# EAGLE design 1541-3m (EAGLE 6.6.0)
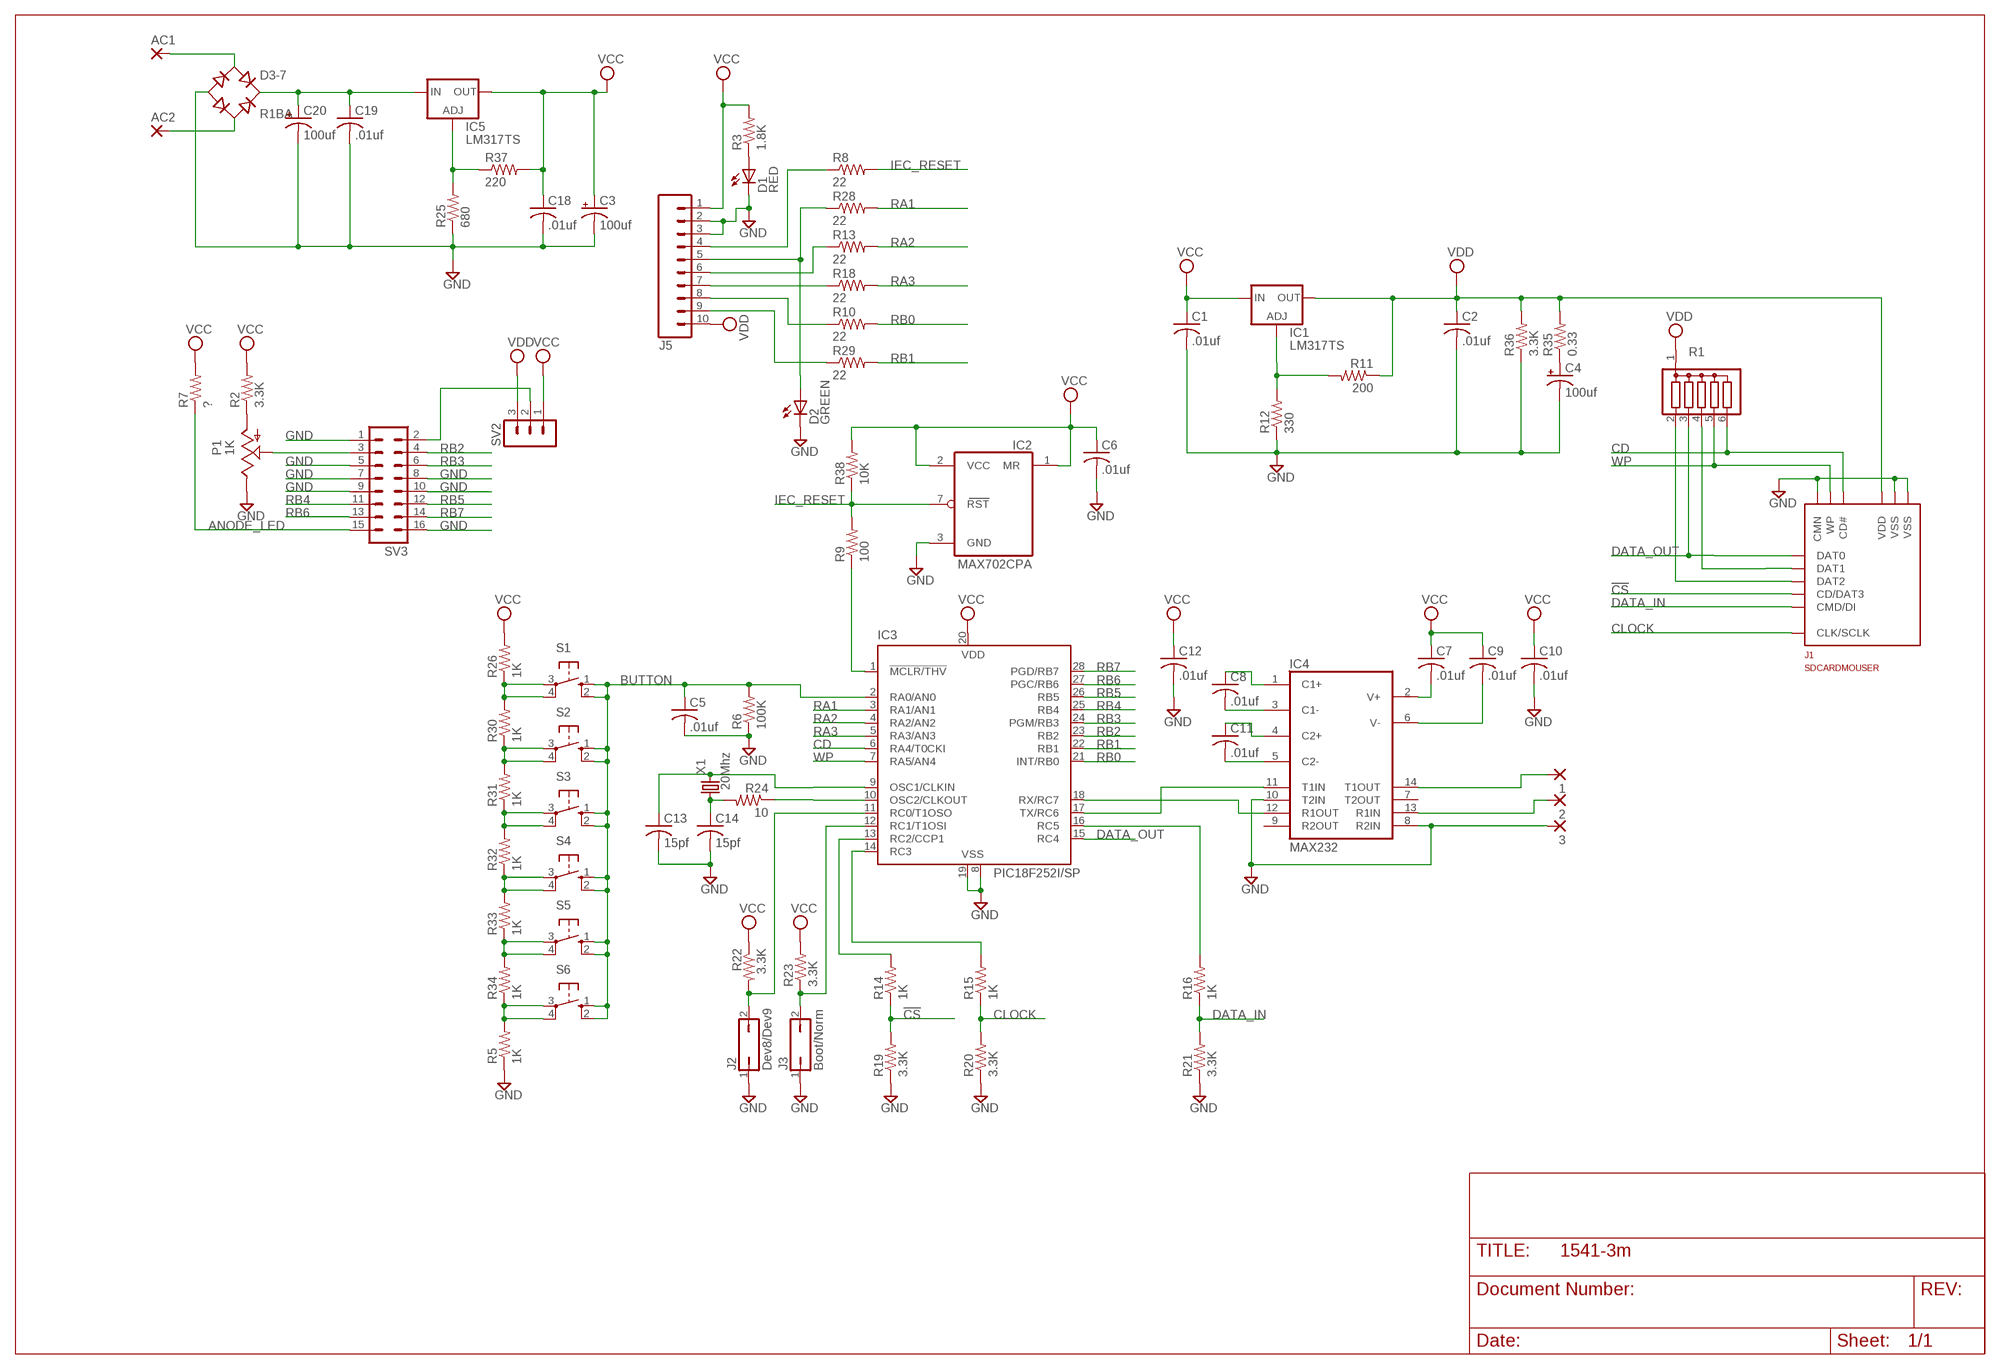
[diagram p0: schematic, sheet 1]

## Parts
1  2,15/1,0  [2,15/1,0]
2  2,15/1,0  [2,15/1,0]
3  2,15/1,0  [2,15/1,0]
AC1  2,15/1,0  [2,15/1,0]
AC2  2,15/1,0  [2,15/1,0]
C1  .01uf  C-US025-024X044  [C025-024X044]
C2  .01uf  C-US025-024X044  [C025-024X044]
C3  100uf  CPOL-USE2-5  [E2-5]
C4  100uf  CPOL-USE2-5  [E2-5]
C5  .01uf  C-US025-024X044  [C025-024X044]
C6  .01uf  C-US025-024X044  [C025-024X044]
C7  .01uf  C-US025-024X044  [C025-024X044]
C8  .01uf  C-US025-024X044  [C025-024X044]
C9  .01uf  C-US025-024X044  [C025-024X044]
C10  .01uf  C-US025-024X044  [C025-024X044]
C11  .01uf  C-US025-024X044  [C025-024X044]
C12  .01uf  C-US025-024X044  [C025-024X044]
C13  15pf  C-US025-024X044  [C025-024X044]
C14  15pf  C-US025-024X044  [C025-024X044]
C18  .01uf  C-US025-024X044  [C025-024X044]
C19  .01uf  C-US025-024X044  [C025-024X044]
C20  100uf  CPOL-USE2-5  [E2-5]
D1  RED  LED3MM  [LED3MM]
D2  GREEN  LED3MM  [LED3MM]
D3-7  R1BA  RB1A  [RB1A]
IC1  LM317TS  [317TS]
IC2  MAX702CPA  [DIL08]
IC3  PIC18F252I/SP  PIC16F870P  [DIL28-3]
IC4  MAX232  [DIL16]
IC5  LM317TS  [317TS]
J1  SDCARDMOUSER  [SCDA1A]
J2  Dev8/Dev9  JP1Q  [JP1]
J3  Boot/Norm  JP1Q  [JP1]
J5  M10  [10P]
P1  1K  TRIM_US-LI10  [LI10]
R1  G05R  [SIL6]
R2  3.3K  R-US_0207/2V  [0207/2V]
R3  1.8K  R-US_0207/2V  [0207/2V]
R5  1K  R-US_0207/2V  [0207/2V]
R6  100K  R-US_0207/2V  [0207/2V]
R7  ?  R-US_0207/2V  [0207/2V]
R8  22  R-US_0207/2V  [0207/2V]
R9  100  R-US_0207/2V  [0207/2V]
R10  22  R-US_0207/2V  [0207/2V]
R11  200  R-US_0207/2V  [0207/2V]
R12  330  R-US_0207/2V  [0207/2V]
R13  22  R-US_0207/2V  [0207/2V]
R14  1K  R-US_0207/2V  [0207/2V]
R15  1K  R-US_0207/2V  [0207/2V]
R16  1K  R-US_0207/2V  [0207/2V]
R18  22  R-US_0207/2V  [0207/2V]
R19  3.3K  R-US_0207/2V  [0207/2V]
R20  3.3K  R-US_0207/2V  [0207/2V]
R21  3.3K  R-US_0207/2V  [0207/2V]
R22  3.3K  R-US_0207/2V  [0207/2V]
R23  3.3K  R-US_0207/2V  [0207/2V]
R24  10  R-US_0207/2V  [0207/2V]
R25  680  R-US_0207/2V  [0207/2V]
R26  1K  R-US_0207/2V  [0207/2V]
R28  22  R-US_0207/2V  [0207/2V]
R29  22  R-US_0207/2V  [0207/2V]
R30  1K  R-US_0207/2V  [0207/2V]
R31  1K  R-US_0207/2V  [0207/2V]
R32  1K  R-US_0207/2V  [0207/2V]
R33  1K  R-US_0207/2V  [0207/2V]
R34  1K  R-US_0207/2V  [0207/2V]
R35  0.33  R-US_0207/2V  [0207/2V]
R36  3.3K  R-US_0207/2V  [0207/2V]
R37  220  R-US_0207/2V  [0207/2V]
R38  10K  R-US_0207/2V  [0207/2V]
S1  10-XX  [B3F-10XX]
S2  10-XX  [B3F-10XX]
S3  10-XX  [B3F-10XX]
S4  10-XX  [B3F-10XX]
S5  10-XX  [B3F-10XX]
S6  10-XX  [B3F-10XX]
SV2  MA03-1  [MA03-1]
SV3  ML16  [ML16]
X1  20Mhz  CRYSTALHC49U70  [HC49U70]

## Nets
!CS: J1.1(CD/DAT3) R14.1 R19.2
ANODE_LED: R7.1 SV3.15
BUTTON: C5.1 IC3.2(RA0/AN0) R6.2 S1.1(S) S1.2(S1) S2.1(S) S2.2(S1) S3.1(S) S3.2(S1) S4.1(S) S4.2(S1) S5.1(S) S5.2(S1) S6.1(S) S6.2(S1)
CD: IC3.6(RA4/T0CKI) J1.10(CD#) R1.6
CLOCK: J1.5(CLK/SCLK) R15.1 R20.2
DATA_IN: J1.2(CMD/DI) R16.1 R21.2
DATA_OUT: IC3.15(RC4) J1.7(DAT0) R1.3
GND: 3.1(P) C1.2 C2.2 C3.- C4.- C5.2 C6.2 C10.2 C12.2 C13.2 C14.2 C18.2 C19.2 C20.- D1.K(C) D2.K(C) D3-7.- IC2.3(GND) IC3.8(VSS) IC3.19(VSS) IC4.8(R2IN) IC4.10(T2IN) J1.3(VSS) J1.6(VSS) J1.11(CMN) J2.1 J3.1 J5.2 J5.3 P1.E R5.1 R6.1 R12.1 R19.1 R20.1 R21.1 R25.1 R36.1 SV3.1 SV3.5 SV3.7 SV3.8 SV3.9 SV3.10 SV3.16
IEC_RESET: IC2.7(RST) R8.2 R9.2 R38.1
N$1: C4.+ R35.1
N$2: J1.9(DAT2) R1.2
N$3: J1.8(DAT1) R1.4
N$4: J5.9 R29.1
N$5: J5.8 R10.1
N$6: J5.7 R18.1
N$7: J5.4 R8.1
N$8: D2.A J5.5 R28.1
N$9: J5.6 R13.1
N$10: D1.A R3.1
N$11: IC3.18(RX/RC7) IC4.12(R1OUT)
N$12: IC3.14(RC3) R15.2
N$13: C14.1 R24.2 X1.1
N$14: IC3.1(!MCLR/THV) R9.1
N$15: C11.1 IC4.4(C2+)
N$16: C11.2 IC4.5(C2-)
N$17: C8.2 IC4.3(C1-)
N$18: C8.1 IC4.1(C1+)
N$19: C7.2 IC4.2(V+)
N$20: C13.1 IC3.9(OSC1/CLKIN) X1.2
N$21: IC3.10(OSC2/CLKOUT) R24.1
N$22: IC3.12(RC1/T1OSI) J3.2 R23.1
N$23: IC3.11(RC0/T1OSO) J2.2 R22.2
N$24: IC3.13(RC2/CCP1) R14.2
N$25: IC3.16(RC5) R16.2
N$26: IC1.1(ADJ) R11.2 R12.2
N$27: IC3.17(TX/RC6) IC4.11(T1IN)
N$28: R26.1 R30.2 S1.3(P) S1.4(P1)
N$29: R30.1 R31.2 S2.3(P) S2.4(P1)
N$30: R31.1 R32.2 S3.3(P) S3.4(P1)
N$31: R5.2 R34.1 S6.3(P) S6.4(P1)
N$32: R33.1 R34.2 S5.3(P) S5.4(P1)
N$33: R32.1 R33.2 S4.3(P) S4.4(P1)
N$34: P1.A R2.1
N$35: SV2.2 SV3.2
N$36: P1.S SV3.3
N$37: C9.2 IC4.6(V-)
N$38: IC5.1(ADJ) R25.2 R37.1
N$39: AC1.1(P) D3-7.AC1
N$40: C19.1 C20.+ D3-7.+ IC5.3(IN)
N$41: AC2.1(P) D3-7.AC2
N$42: 2.1(P) IC4.13(R1IN)
N$43: 1.1(P) IC4.14(T1OUT)
RA1: IC3.3(RA1/AN1) R28.2
RA2: IC3.4(RA2/AN2) R13.2
RA3: IC3.5(RA3/AN3) R18.2
RB0: IC3.21(INT/RB0) R10.2
RB1: IC3.22(RB1) R29.2
RB2: IC3.23(RB2) SV3.4
RB3: IC3.24(PGM/RB3) SV3.6
RB4: IC3.25(RB4) SV3.11
RB5: IC3.26(RB5) SV3.12
RB6: IC3.27(PGC/RB6) SV3.13
RB7: IC3.28(PGD/RB7) SV3.14
VCC: C1.1 C3.+ C6.1 C7.1 C9.1 C10.1 C12.1 C18.1 IC1.3(IN) IC2.1(MR) IC2.2(VCC) IC3.20(VDD) IC5.2(OUT) J5.1 R2.2 R3.2 R7.2 R22.1 R23.2 R26.2 R37.2 R38.2 SV2.1
VDD: C2.1 IC1.2(OUT) J1.4(VDD) J5.10 R1.1 R11.1 R35.2 R36.2 SV2.3
WP: IC3.7(RA5/AN4) J1.12(WP) R1.5
Unconnected: IC4.7(T2OUT) IC4.9(R2OUT)

## Power pins joined to a net without a drawn wire
GND: IC4.15(GND) J1.13(GND) J1.14(GND)
VCC: IC4.16(VCC)

## Library data of the parts
1-3 AC1 AC2 = wirepad:2,15/1,0: THROUGH-HOLE PAD
C1 C2 C5-C14 C18 C19 = rcl:C-US: CAPACITOR, American symbol
C3 C4 C20 = rcl:CPOL-US: POLARIZED CAPACITOR, American symbol
D1 D2 = led:LED: LED OSRAM: - CHIPLED LG R971, LG N971, LY N971, LG Q971, LY Q971, LO R971, LY R971 LH N974, LH R974 LS Q976, LO Q976, LY Q976 LO Q996 - Hyper CHIPLED LW Q18S LB Q993, LB Q99A, LB R99A - SideLED LS A670, LO A670, LY A670, LG A670, LP A670 LB A673, LV A673, LT A673, LW A673 LH A674 LY A675 LS A676, LA A676, LO A676, LY A676, LW A676 LS A679, LY A679, LG A679 - Hyper Micro SIDELED® LS Y876, LA Y876, LO Y876, LY Y876 LT Y87S - SmartLED LW L88C, LW L88S LB L89C, LB L89S, LG L890 LS L89K, LO L89K, LY L89K LS L896, LA L896, LO L896, LY L896 - TOPLED LS T670, LO T670, LY T670, LG T670, LP T670 LSG T670, LSP T670, LSY T670, LOP T670, LYG T670 LG T671, LOG T671, LSG T671 LB T673, LV T673, LT T673, LW T673 LH T674 LS T676, LA T676, LO T676, LY T676, LB T676, LH T676, LSB T676, LW T676 LB T67C, LV T67C, LT T67C, LS T67K, LO T67K, LY T67K, LW E67C LS E67B, LA E67B, LO E67B, LY E67B, LB E67C, LV E67C, LT E67C LW T67C LS T679, LY T679, LG T679 LS T770, LO T770, LY T770, LG T770, LP T770 LB T773, LV T773, LT T773, LW T773 LH T774 LS E675, LA E675, LY E675, LS T675 LS T776, LA T776, LO T776, LY T776, LB T776 LHGB T686 LT T68C, LB T68C - Hyper Mini TOPLED® LB M676 - Mini TOPLED Santana® LG M470 LS M47K, LO M47K, LY M47K Source: http://www.osram.convergy.de LUXEON: - LUMILED® LXK2-PW12-R00, LXK2-PW12-S00, LXK2-PW14-U00, LXK2-PW14-V00 LXK2-PM12-R00, LXK2-PM12-S00, LXK2-PM14-U00 LXK2-PE12-Q00, LXK2-PE12-R00, LXK2-PE12-S00, LXK2-PE14-T00, LXK2-PE14-U00 LXK2-PB12-K00, LXK2-PB12-L00, LXK2-PB12-M00, LXK2-PB14-N00, LXK2-PB14-P00, LXK2-PB14-Q00 LXK2-PR12-L00, LXK2-PR12-M00, LXK2-PR14-Q00, LXK2-PR14-R00 LXK2-PD12-Q00, LXK2-PD12-R00, LXK2-PD12-S00 LXK2-PH12-R00, LXK2-PH12-S00 LXK2-PL12-P00, LXK2-PL12-Q00, LXK2-PL12-R00 Source: www.luxeon.com KINGBRIGHT: KA-3528ASYC Source: www.kingbright.com
D3-7 = rectifier:RB1A: RECTIFIER 1 A
IC1 IC5 = v-reg:LM317TS: VOLTAGE REGULATOR
IC2 = maxim:MAX702CPA: POWER SUPPLY MONITOR; MF: MAXIM; MPN: MAX702CPA+; OC_FARNELL: 1188018; OC_NEWARK: 69K6744
IC3 = microchip:PIC16*870: MICROCONTROLLER flash type; MF: MICROCHIP; MPN: PIC16F870-I/SP; OC_FARNELL: 9760954; OC_NEWARK: 19C7275
IC4 = maxim:MAX232: RS232 TRANSCEIVER; MF: MAXIM; MPN: MAX232ACPE+; OC_FARNELL: 9723773; OC_NEWARK: 68K4544
J1 = sdcards:SDCARD: SD Card Holder
J2 J3 = jumper:JP1Q: JUMPER
J5 = con-amp-quick:M10: AMP QUICK CONNECTOR; OC_FARNELL: unknown; OC_NEWARK: unknown
P1 = pot:TRIM_US-: POTENTIOMETER
R1 = resistor-sil:G05R: SIL RESISTOR; OC_FARNELL: unknown; OC_NEWARK: unknown
R2 R3 R5-R16 R18-R26 R28-R38 = rcl:R-US_: RESISTOR, American symbol
S1-S6 = switch-omron:10-XX: OMRON SWITCH; MPN: B3F-1000; OC_FARNELL: 176432; OC_NEWARK: 36M3542
SV2 = con-lstb:MA03-1: PIN HEADER; OC_FARNELL: unknown; OC_NEWARK: unknown
SV3 = con-harting-ml:ML16: HARTING; OC_FARNELL: unknown; OC_NEWARK: unknown
X1 = crystal:CRYSTAL: CRYSTAL; OC_FARNELL: unknown; OC_NEWARK: unknown

## Board
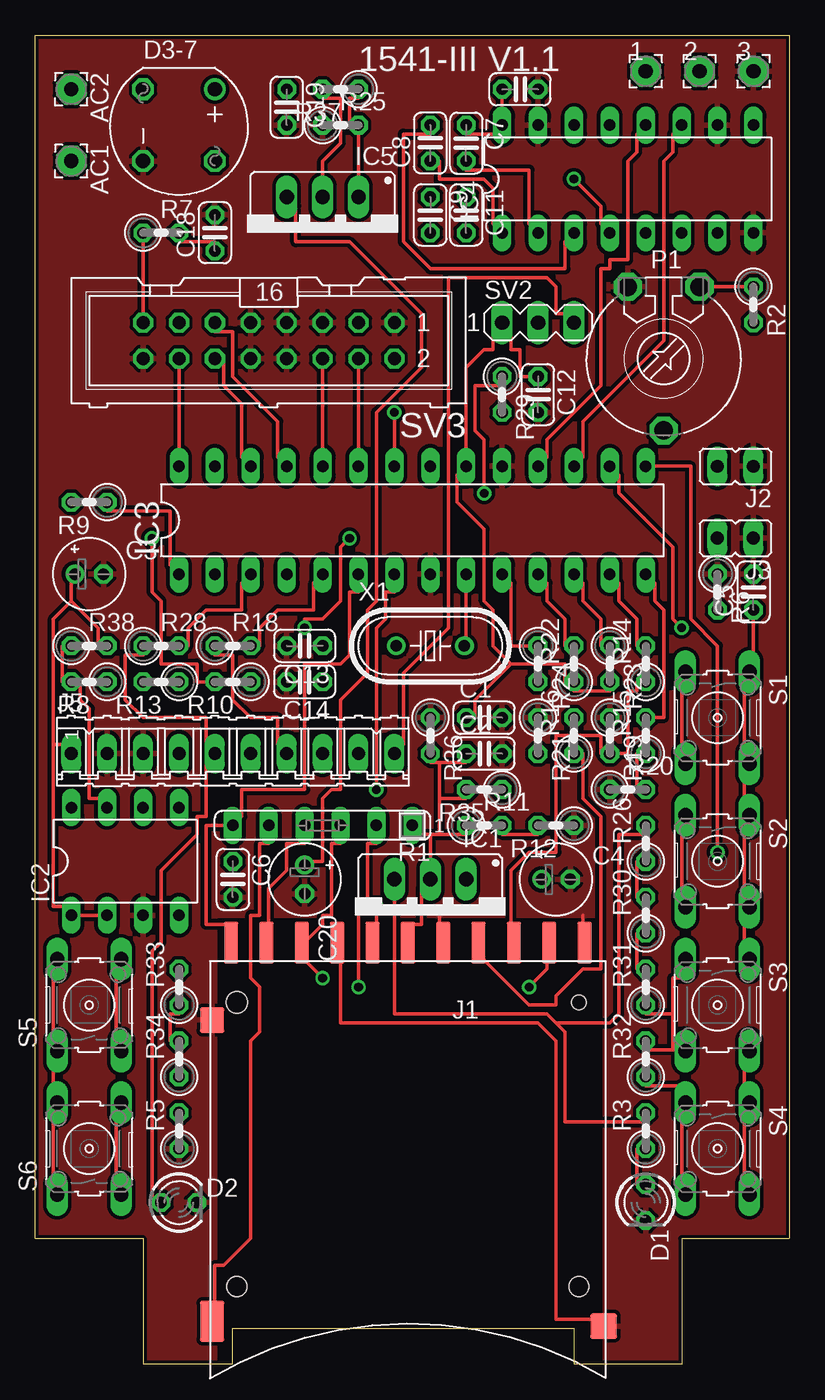
[diagram p1: board, top side]
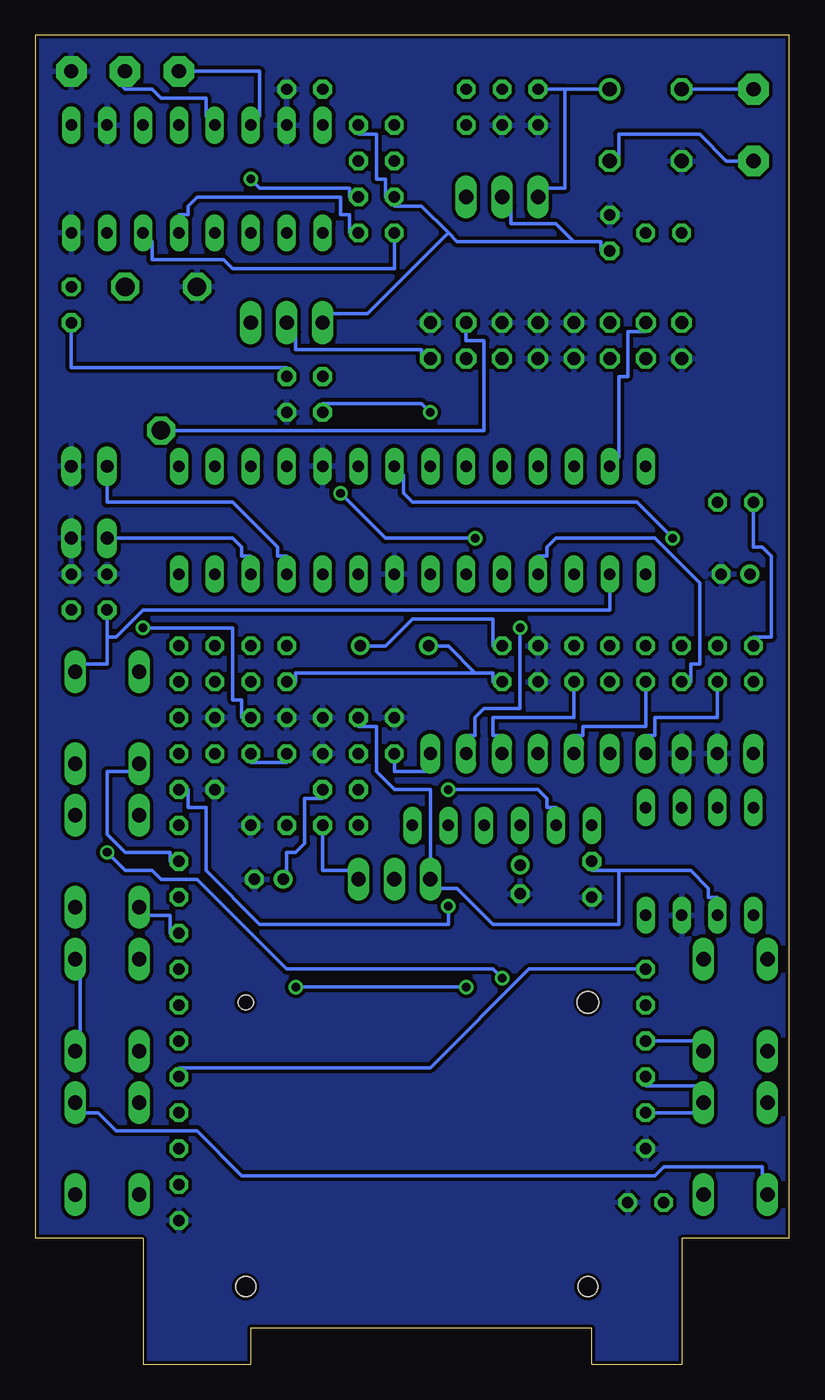
[diagram p2: board, bottom side, seen from below]

Size 53.34 x 93.98 mm. Coordinates in mm from the lower left corner, seen from the top.
Outline: 0,93.98 53.34,93.98 53.34,8.89 45.72,8.89 45.72,0 38.1,0 38.1,2.54 13.97,2.54 13.97,0 7.62,0 7.62,8.89 0,8.89 0,93.98
Copper layers (1*16): Top 0.035mm / dielectric 1.5mm / Bottom 0.035mm
Design rules "olimex10mil": minimum track width 10mil, minimum drill 24mil, track to track 10mil, track to pad 10mil, pad to pad 10mil, via to via 10mil, smd to smd 10mil, copper to edge 10mil, drill to drill 10mil, minimum pad ring 10mil, minimum via ring 8mil, stop-mask expansion 0mil, vias tented up to drill 0mil, thermal gap 10mil

### Footprints (pad centres in the part's own frame; a part is rotated, then mirrored left to right if it is on the bottom)
2,15/1,0 = drill 1.016 pad 2.159 octagon: 1 0,0
C025-024X044 = drill 0.813 octagon: 1 -1.27,0; 2 1.27,0
E2-5 = drill 0.813 pad 1.27: + -1.016,0 | drill 0.813 pad 1.27 octagon: - 1.016,0
LED3MM = drill 0.813 octagon: A -1.27,0; K 1.27,0
RB1A = drill 1.016: + -2.54,2.54 | drill 1.016 octagon: - 2.54,-2.54; AC1 2.54,2.54; AC2 -2.54,-2.54
317TS = drill 1.016 long: 1 -2.54,-2.54; 2 0,-2.54; 3 2.54,-2.54
DIL08 = drill 0.813 long: 1 -3.81,-3.81; 2 -1.27,-3.81; 3 1.27,-3.81; 4 3.81,-3.81; 5 3.81,3.81; 6 1.27,3.81; 7 -1.27,3.81; 8 -3.81,3.81
DIL28-3 = drill 0.813 long: 1 -16.51,-3.81; 2 -13.97,-3.81; 3 -11.43,-3.81; 4 -8.89,-3.81; 5 -6.35,-3.81; 6 -3.81,-3.81; 7 -1.27,-3.81; 8 1.27,-3.81; 9 3.81,-3.81; 10 6.35,-3.81; 11 8.89,-3.81; 12 11.43,-3.81; 13 13.97,-3.81; 14 16.51,-3.81; 15 16.51,3.81; 16 13.97,3.81; 17 11.43,3.81; 18 8.89,3.81; 19 6.35,3.81; 20 3.81,3.81; 21 1.27,3.81; 22 -1.27,3.81; 23 -3.81,3.81; 24 -6.35,3.81; 25 -8.89,3.81; 26 -11.43,3.81; 27 -13.97,3.81; 28 -16.51,3.81
DIL16 = drill 0.813 long: 1 -8.89,-3.81; 2 -6.35,-3.81; 3 -3.81,-3.81; 4 -1.27,-3.81; 5 1.27,-3.81; 6 3.81,-3.81; 7 6.35,-3.81; 8 8.89,-3.81; 9 8.89,3.81; 10 6.35,3.81; 11 3.81,3.81; 12 1.27,3.81; 13 -1.27,3.81; 14 -3.81,3.81; 15 -6.35,3.81; 16 -8.89,3.81
SCDA1A = smd 1 x 2.95: 1 -7.5,-10.125; 2 -5,-10.125; 3 -2.5,-10.125; 4 0,-10.125; 5 2.5,-10.125; 6 5,-10.125; 7 7.5,-10.125; 8 10,-10.125; 9 -10,-10.125; 10 12.5,-10.125; 13 -12.5,-10.125 | smd 1.7 x 1.8: 11 13.85,-4.65 | smd 1.7 x 2.9: 12 13.85,16.65 | smd 1.9 x 1.8: 14 -13.85,17 | hole 1.05: -12.1,-5.9 | hole 1.5: 12.1,-5.9 | hole 1.4: 12.1,14.2; -12.1,14.2
JP1 = drill 0.914 long: 1 0,-1.27; 2 0,1.27
10P = drill 0.914 long: 1 -11.43,0; 2 -8.89,0; 3 -6.35,0; 4 -3.81,0; 5 -1.27,0; 6 1.27,0; 7 3.81,0; 8 6.35,0; 9 8.89,0; 10 11.43,0
LI10 = drill 1.321 octagon: A -2.54,-5.08; E 2.54,-5.08; S 0,5.08
SIL6 = drill 0.813 long: 1 -6.35,0; 2 -3.81,0; 3 -1.27,0; 4 1.27,0; 5 3.81,0; 6 6.35,0
0207/2V = drill 0.813 octagon: 1 -1.27,0; 2 1.27,0
B3F-10XX = drill 1.016 long: 1 -3.251,2.261; 2 3.251,2.261; 3 -3.251,-2.261; 4 3.251,-2.261
MA03-1 = drill 1.016 long: 1 -2.54,0; 2 0,0; 3 2.54,0
ML16 = drill 0.914 octagon: 1 -8.89,-1.27; 2 -8.89,1.27; 3 -6.35,-1.27; 4 -6.35,1.27; 5 -3.81,-1.27; 6 -3.81,1.27; 7 -1.27,-1.27; 8 -1.27,1.27; 9 1.27,-1.27; 10 1.27,1.27; 11 3.81,-1.27; 12 3.81,1.27; 13 6.35,-1.27; 14 6.35,1.27; 15 8.89,-1.27; 16 8.89,1.27
HC49U70 = drill 0.813: 1 -2.413,0; 2 2.413,0

### Placement (x,y rotation side)
1  43.18,91.44 0 top
2  46.99,91.44 0 top
3  50.8,91.44 0 top
AC1  2.54,85.09 270 top
AC2  2.54,90.17 270 top
C1  31.75,45.72 0 top
C2  31.75,43.18 0 top
C3  3.81,55.88 0 top
C4  36.83,34.29 0 top
C5  50.8,54.61 90 top
C6  13.97,34.29 270 top
C7  30.48,86.36 270 top
C8  27.94,86.36 90 top
C9  27.94,81.28 270 top
C10  34.29,90.17 0 top
C11  30.48,81.28 270 top
C12  35.56,68.58 270 top
C13  19.05,50.8 180 top
C14  19.05,48.26 180 top
C18  12.7,80.01 90 top
C19  17.78,88.9 270 top
C20  19.05,34.29 270 top
D1  43.18,11.43 270 top
D2  10.16,11.43 0 top
D3-7  10.16,87.63 270 top
IC1  27.94,31.75 180 top
IC2  6.35,35.56 0 top
IC3  26.67,59.69 0 top
IC4  41.91,83.82 0 top
IC5  20.32,80.01 180 top
J1  26.35,19.68 180 top
J2  49.53,63.5 90 top
J3  49.53,58.42 90 top
J5  13.97,43.18 0 top
P1  44.45,71.12 180 top
R1  20.32,38.1 180 top
R2  50.8,74.93 270 top
R3  43.18,16.51 90 top
R5  10.16,16.51 90 top
R6  48.26,54.61 270 top
R7  8.89,80.01 0 top
R8  3.81,48.26 180 top
R9  3.81,60.96 180 top
R10  13.97,48.26 180 top
R11  31.75,38.1 0 top
R12  36.83,38.1 180 top
R13  8.89,48.26 180 top
R14  43.18,49.53 90 top
R15  43.18,44.45 90 top
R16  38.1,44.45 90 top
R18  13.97,50.8 0 top
R19  40.64,44.45 270 top
R20  41.91,40.64 0 top
R21  35.56,44.45 270 top
R22  38.1,49.53 90 top
R23  40.64,49.53 270 top
R24  35.56,49.53 270 top
R25  21.59,87.63 0 top
R26  43.18,36.83 90 top
R28  8.89,50.8 0 top
R29  33.02,68.58 270 top
R30  43.18,31.75 90 top
R31  43.18,26.67 90 top
R32  43.18,21.59 90 top
R33  10.16,26.67 90 top
R34  10.16,21.59 90 top
R35  31.75,40.64 180 top
R36  27.94,44.45 270 top
R37  21.59,90.17 180 top
R38  3.81,50.8 0 top
S1  48.26,45.72 270 top
S2  48.26,35.56 270 top
S3  48.26,25.4 270 top
S4  48.26,15.24 270 top
S5  3.81,25.4 90 top
S6  3.81,15.24 90 top
SV2  35.56,73.66 0 top
SV3  16.51,72.39 180 top
X1  27.94,50.8 0 top

### Tracks (layer width: path | path; a pad name or v marks a point on that pad's centre or on a via)
!CS
  Top 0.254: R14.1 42.55,48.26 42.55,47.62 41.91,47.62 41.91,43.18 41.27,43.18 R19.2 40.01,43.18 40.01,44.45 36.83,44.45 36.83,36.2 34.92,36.2 33.66,34.92 33.66,31.11 J1.1
ANODE_LED
  Top 0.254: R7.1 7.62,79.38 7.62,74.3 SV3.15
BUTTON
  Top 0.254: C5.1 50.8,52.7 50.8,50.16 S1.1 50.16,47.62 50.16,43.81 S1.2 50.16,41.27 50.16,40.01 S2.1 50.16,37.47 50.16,33.66 S2.2 50.16,31.11 50.16,29.84 S3.1 | S6.1 1.27,13.34 1.27,17.14 S6.2 1.27,19.68 1.27,20.95 S5.1 1.27,23.5 1.27,27.3 S5.2 | S4.2 50.16,13.34 50.16,17.14 S4.1 50.16,19.68 50.16,20.95 S3.2
  Bottom 0.254: 48.26,51.44 48.26,49.53 50.16,49.53 S1.1 | 48.26,51.44 48.26,52.7 R6.2 | 48.26,51.44 47.62,51.44 45.72,53.34 12.7,53.34 12.7,54.61 IC3.2 | S3.2 50.16,23.5 50.16,27.3 S3.1 | S6.1 1.91,13.34 1.91,13.97 8.89,13.97 9.53,13.34 38.73,13.34 41.91,16.51 47.62,16.51 48.9,17.78 50.16,17.78 S4.1
CD
  Top 0.254: J1.10 13.97,31.11 12.06,31.11 12.06,38.1 13.34,38.1 R1.6 14.61,38.73 14.61,40.64 19.05,40.64 19.05,49.53 21.59,49.53 22.23,50.16 22.23,54.61 22.86,54.61 IC3.6
CLOCK  (via drill 0.61)
  Top 0.254: R20.2 42.55,40.64 42.55,43.18 R15.1 | v24.13,32.38 24.13,31.11 J1.5
  Bottom 0.254: v24.13,32.38 24.13,31.11 37.47,31.11 41.27,34.92 41.27,39.37 42.55,39.37 42.55,40.64 R20.2
DATA_IN
  Top 0.254: J1.2 31.75,28.57 34.92,25.4 36.83,25.4 36.83,26.04 38.73,27.94 40.01,27.94 40.01,38.73 38.73,40.01 38.73,43.18 R16.1
  Bottom 0.254: R21.2 35.56,42.55 38.1,42.55 R16.1
DATA_OUT  (via drill 0.61)
  Top 0.254: R1.3 21.59,36.83 20.95,36.83 20.95,31.75 20.32,31.75 20.32,31.11 19.05,29.84 J1.7 19.05,28.57 v20.32,27.3 | v48.26,36.2 48.26,50.8 46.35,52.7 46.35,63.5 43.81,63.5 IC3.15
  Bottom 0.254: v48.26,36.2 46.99,34.92 45.09,34.92 44.45,34.29 41.91,34.29 35.56,27.94 20.95,27.94 v20.32,27.3
GND
  Top 0.254: 40.41,1.91 40.64,1.91 J1.14 39.37,3.17 36.83,3.17 36.83,22.86 35.56,24.13 21.59,24.13 21.59,28.57 J1.6 | 28.57,31.75 28.57,31.11 J1.3 | 38.73,31.75 38.73,31.11 J1.13
  pour Bottom: 0,0 53.34,0 53.34,93.98 0,93.98
  pour Top: 0,0 12.7,0 12.7,31.75 40.32,31.75 40.32,0 53.34,0 53.34,93.98 0,93.98
IEC_RESET
  Top 0.254: R38.1 1.91,50.8 1.91,48.26 R8.2 3.17,48.26 3.17,46.99 3.81,46.35 3.81,40.01 4.45,40.01 IC2.7
  Bottom 0.254: R9.2 2.54,60.33 2.54,57.78 1.91,57.78 1.27,57.15 1.27,51.44 2.54,51.44 R38.1
N$1
  Bottom 0.254: C4.+ 35.56,34.92 35.56,36.2 34.92,36.2 34.29,36.83 34.29,40.01 33.02,40.01 R35.1
N$2  (via drill 0.61)
  Top 0.254: v22.86,26.67 22.86,32.38 23.5,33.02 23.5,36.83 24.13,36.83 R1.2 | v34.92,26.67 36.2,27.94 36.2,28.57 J1.9
  Bottom 0.254: v22.86,26.67 v34.92,26.67
N$3
  Top 0.254: R1.4 19.05,36.83 17.78,36.83 17.78,34.92 16.51,33.66 16.51,31.11 J1.8
N$4  (via drill 0.61)
  Top 0.254: v31.75,61.59 31.75,65.41 31.11,66.04 31.11,69.22 33.02,69.22 R29.1 | v22.23,58.42 21.59,57.78 21.59,53.98 20.32,52.7 19.05,52.7 v19.05,52.07
  Bottom 0.254: v31.75,61.59 28.57,58.42 v22.23,58.42 | v19.05,52.07 19.05,46.35 21.59,46.35 22.23,45.72 22.23,44.45 22.86,44.45 J5.9
N$5
  Bottom 0.254: R10.1 15.24,47.62 15.24,45.72 20.95,45.72 20.95,44.45 20.32,44.45 J5.8
N$6
  Top 0.254: R18.1 12.7,50.16 13.97,50.16 13.97,46.99 15.24,45.72 17.14,45.72 17.14,43.81 J5.7
N$7
  Bottom 0.254: R8.1 5.08,47.62 5.08,45.72 9.53,45.72 9.53,44.45 10.16,44.45 J5.4
N$8
  Top 0.254: D2.A 8.26,11.43 8.26,29.21 8.89,29.84 8.89,34.92 11.43,37.47 11.43,38.73 12.06,38.73 12.06,42.55 J5.5 12.06,43.81 12.06,45.72 7.62,45.72 6.35,46.99 6.35,50.16 7.62,50.16 R28.1
N$9
  Bottom 0.254: R13.1 10.16,47.62 10.16,45.09 14.61,45.09 14.61,44.45 15.24,44.45 J5.6
N$10
  Top 0.254: D1.A 42.55,12.7 42.55,15.24 R3.1
N$11
  Top 0.254: IC3.18 36.2,64.14 36.2,65.41 40.01,69.22 40.01,77.47 40.64,77.47 40.64,78.11 41.91,78.11 41.91,85.09 42.55,85.72 42.55,87 IC4.12
N$12
  Top 0.254: R15.2 43.81,45.72 44.45,45.72 44.45,53.34 43.81,53.98 43.81,55.24 IC3.14
N$13
  Bottom 0.254: 22.23,48.9 20.95,48.9 20.95,48.26 C14.1 | 22.23,48.9 24.13,50.8 25.4,50.8 X1.1 | 22.23,48.9 34.92,48.9 34.92,48.26 R24.2
N$14
  Top 0.254: R9.1 5.08,60.33 9.53,60.33 9.53,56.52 IC3.1
N$15  (via drill 0.61)
  Top 0.254: v38.1,83.82 40.01,81.92 40.01,80.64 IC4.4
  Bottom 0.254: v38.1,83.82 37.47,83.19 31.11,83.19 31.11,82.55 C11.1
N$16
  Bottom 0.254: C11.2 31.11,80.01 31.11,81.28 31.75,81.28 31.75,82.55 41.91,82.55 42.55,81.92 42.55,81.28 43.18,81.28 IC4.5
N$17
  Top 0.254: C8.2 27.94,87 26.04,87 26.04,79.38 27.94,77.47 37.47,77.47 37.47,79.38 IC4.3
N$18
  Top 0.254: IC4.1 32.38,80.64 32.38,83.19 31.75,83.82 28.57,83.82 28.57,85.09 C8.1
N$19
  Top 0.254: C7.2 30.48,84.45 34.92,84.45 34.92,80.64 IC4.2
N$20
  Top 0.254: IC3.9 30.48,54.61 30.48,51.44 X1.2
  Bottom 0.254: C13.1 20.95,50.8 20.95,52.7 26.67,52.7 28.57,50.8 29.84,50.8 X1.2
N$21
  Top 0.254: R24.1 34.92,50.8 33.66,50.8 33.66,55.24 IC3.10
N$22
  Top 0.254: R23.1 40.01,50.8 40.01,52.7 38.73,53.98 38.73,55.24 IC3.12
  Bottom 0.254: J3.2 47.62,58.42 39.37,58.42 38.73,57.78 38.73,57.15 38.1,57.15 IC3.12
N$23
  Top 0.254: R22.2 37.47,50.8 37.47,52.7 36.2,53.98 36.2,55.24 IC3.11
  Bottom 0.254: J2.2 48.26,62.23 48.26,60.96 39.37,60.96 36.2,57.78 36.2,57.15 35.56,57.15 IC3.11
N$24
  Top 0.254: R14.2 42.55,50.8 42.55,52.7 41.27,53.98 41.27,55.24 IC3.13
N$25  (via drill 0.61)
  Top 0.254: v45.72,52.07 45.09,52.7 45.09,57.78 41.27,61.59 41.27,62.87 IC3.16
  Bottom 0.254: v45.72,52.07 39.37,52.07 39.37,46.99 38.73,46.99 38.73,45.72 R16.2
N$26
  Top 0.254: R12.2 35.56,37.47 33.02,37.47 R11.2
  Bottom 0.254: R11.2 33.02,37.47 33.02,34.92 31.11,34.92 IC1.1
N$27
  Top 0.254: IC3.17 38.73,64.14 38.73,66.67 44.45,72.39 44.45,85.09 45.09,85.72 45.09,87 IC4.11
N$28
  Top 0.254: R30.2 42.55,33.02 42.55,35.56 R26.1 | S1.4 45.72,43.81 45.72,47.62 S1.3
  Bottom 0.254: R26.1 43.81,35.56 43.81,36.2 46.99,36.2 48.26,37.47 48.26,41.91 46.35,41.91 S1.4
N$29
  Top 0.254: R31.2 42.55,27.94 42.55,30.48 R30.1 | S2.4 45.72,33.66 45.72,37.47 S2.3
  Bottom 0.254: R30.1 43.81,30.48 43.81,31.75 45.72,31.75 S2.4
N$30
  Top 0.254: 45.09,22.23 45.72,22.23 S3.4 | 45.09,22.23 43.18,22.23 R32.2 | 45.09,24.77 43.18,24.77 R31.1 | 45.09,22.23 45.09,24.77 | 45.09,24.77 45.09,27.3 45.72,27.3 S3.3
N$31
  Top 0.254: S6.3 5.71,13.34 5.71,17.14 S6.4
  Bottom 0.254: R5.2 9.53,17.78 6.35,17.78 S6.4 6.35,19.68 10.16,19.68 R34.1
N$32
  Top 0.254: R33.1 10.16,24.77 9.53,24.77 9.53,22.86 R34.2 | S5.4 5.71,27.3 5.71,23.5 S5.3
  Bottom 0.254: R34.2 9.53,22.86 6.35,22.86 S5.3
N$33
  Top 0.254: S4.4 45.72,13.34 45.72,17.14 S4.3 45.72,19.68 43.18,19.68 R32.1
  Bottom 0.254: R33.2 10.79,27.94 18.41,27.94 25.4,20.95 43.18,20.95 R32.1
N$34
  Top 0.254: R2.1 50.16,76.2 47.62,76.2 P1.A
N$35
  Bottom 0.254: SV3.2 26.04,71.12 26.04,71.75 34.92,71.75 34.92,73.03 SV2.2
N$36
  Bottom 0.254: SV3.3 22.86,73.03 22.86,72.39 21.59,72.39 21.59,66.04 43.81,66.04 P1.S
N$37
  Bottom 0.254: C9.2 27.94,79.38 27.94,77.47 39.37,77.47 40.01,78.11 45.09,78.11 45.09,79.38 IC4.6
N$38
  Top 0.254: IC5.1 22.86,83.82 22.86,87 R25.2 22.23,87.63 22.23,89.53 22.86,89.53 R37.1
N$39
  Bottom 0.254: D3-7.AC1 12.06,85.09 12.06,87 6.35,87 4.45,85.09 3.17,85.09 AC1.1
N$40
  Top 0.254: C20.+ 19.68,35.56 20.32,35.56 20.32,40.01 20.95,40.64 21.59,40.64 21.59,46.99 23.5,48.9 23.5,53.34 24.13,53.98 24.13,67.31 27.3,70.48 27.3,74.3 22.23,79.38 18.41,79.38 18.41,81.92 IC5.3
  Bottom 0.254: 15.88,90.17 13.34,90.17 D3-7.+ | 15.88,90.17 17.14,90.17 C19.1 | 15.88,90.17 15.88,83.19 17.14,83.19 IC5.3
N$41
  Bottom 0.254: D3-7.AC2 6.99,90.17 3.17,90.17 AC2.1
N$42
  Bottom 0.254: IC4.13 41.27,88.27 41.27,89.53 44.45,89.53 45.09,90.17 46.99,90.17 47.62,90.81 2.1
N$43
  Bottom 0.254: IC4.14 37.47,88.27 37.47,91.44 42.55,91.44 1.1
RA1
  Top 0.254: R28.2 10.79,50.8 10.79,52.07 12.06,53.34 14.61,53.34 14.61,55.24 IC3.3
RA2
  Bottom 0.254: R13.2 6.99,48.26 6.99,49.53 6.35,49.53 6.35,55.24 9.53,58.42 16.51,58.42 17.14,57.78 17.14,57.15 17.78,57.15 IC3.4
RA3
  Top 0.254: R18.2 15.88,50.8 15.88,52.07 17.14,53.34 19.68,53.34 19.68,55.24 IC3.5
RB0  (via drill 0.61)
  Top 0.254: v8.26,58.42 8.26,54.61 8.89,53.98 8.89,49.53 11.43,49.53 11.43,48.26 12.06,48.26 R10.2
  Bottom 0.254: v8.26,58.42 10.79,60.96 26.67,60.96 27.3,61.59 27.3,62.87 IC3.21
RB1  (via drill 0.61)
  Top 0.254: v25.4,67.31 25.4,64.77 IC3.22
  Bottom 0.254: v25.4,67.31 26.04,67.94 33.02,67.94 R29.2
RB2
  Top 0.254: IC3.23 22.86,64.77 22.86,70.48 SV3.4
RB3
  Top 0.254: IC3.24 20.32,64.77 20.32,70.48 SV3.6
RB4
  Top 0.254: IC3.25 17.14,64.14 17.14,66.67 13.97,69.85 13.97,73.03 12.7,73.03 SV3.11
RB5
  Top 0.254: IC3.26 14.61,64.14 14.61,67.94 13.34,69.22 13.34,71.12 SV3.12
RB6
  Bottom 0.254: IC3.27 12.06,64.14 12.06,69.85 11.43,69.85 11.43,73.03 10.16,73.03 SV3.13
RB7
  Top 0.254: IC3.28 10.16,64.77 10.16,70.48 SV3.14
VCC
  Top 0.254: IC2.2 4.45,31.75 3.17,31.75 IC2.1 1.91,32.38 1.27,32.38 1.27,43.81 | 2.54,53.98 4.45,52.07 4.45,50.8 R38.2 | 2.54,53.98 2.54,55.24 C3.+ | 1.27,43.81 1.91,43.81 J5.1 | 1.27,43.81 1.27,52.7 2.54,53.98 | 36.83,24.13 36.2,24.77 25.4,24.77 25.4,33.02 IC1.3 | 36.83,24.13 37.47,23.5 37.47,17.14 43.18,17.14 R3.2 | 36.83,24.13 40.64,24.13 41.27,24.77 41.27,37.47 43.18,37.47 R26.2 | C10.1 33.02,89.53 33.02,88.9 IC4.16 32.38,87 30.48,87 C7.1 | R7.2 10.16,79.38 12.7,79.38 C18.1 | R37.2 20.32,89.53 21.59,89.53 21.59,86.36 20.32,85.09 20.32,83.82 IC5.2 | 33.66,49.53 31.11,46.99 31.11,45.72 C1.1 | 33.66,49.53 37.47,49.53 37.47,48.26 R22.1 38.1,47.62 40.64,47.62 R23.2 | C12.1 34.92,69.85 34.29,69.85 34.29,71.75 33.66,71.75 33.66,73.03 SV2.1 32.38,73.03 32.38,71.75 31.75,71.75 30.48,70.48 30.48,64.77 IC3.20 29.84,62.87 29.84,60.96 31.75,59.05 31.75,53.98 32.38,53.34 32.38,50.8 33.66,49.53
  Bottom 0.254: 12.06,34.92 6.99,34.92 5.71,33.66 5.71,33.02 5.08,33.02 IC2.2 | 12.06,34.92 13.97,34.92 C6.1 | 12.06,34.92 12.06,31.11 20.95,31.11 23.5,33.66 24.77,33.66 IC1.3 25.4,35.56 25.4,40.64 27.94,40.64 29.21,41.91 29.21,45.09 30.48,45.09 C1.1 | C7.1 30.48,87 29.21,87 29.21,83.82 28.57,83.82 28.57,82.55 C9.1 27.94,81.92 26.04,81.92 24.13,80.01 | 15.24,79.38 13.34,79.38 13.34,78.74 C18.1 | 15.24,79.38 16.51,80.64 19.68,80.64 19.68,81.92 IC5.2 | 24.13,80.01 23.5,79.38 15.24,79.38 | R2.2 50.8,73.03 50.8,70.48 35.56,70.48 C12.1 | 24.13,80.01 29.84,74.3 32.38,74.3 SV2.1
VDD
  Top 0.254: 27.94,37.47 27.3,37.47 R1.1 | 27.94,37.47 27.94,35.56 IC1.2 27.3,33.66 27.3,31.11 26.67,31.11 J1.4 | 27.94,37.47 28.57,37.47 | 28.57,37.47 30.48,37.47 R11.1 | 28.57,40.01 30.48,40.01 R35.2 | 28.57,37.47 28.57,40.01 | 28.57,42.55 27.94,42.55 R36.2 | 28.57,42.55 30.48,42.55 C2.1 | SV2.3 37.47,74.3 36.83,74.3 36.83,76.2 36.2,76.83 29.21,76.83 29.21,52.07 26.04,48.9 26.04,43.81 J5.10 | 28.57,40.01 28.57,42.55
  Bottom 0.254: R36.2 27.94,42.55 27.94,41.91 25.4,41.91 J5.10
WP  (via drill 0.61)
  Top 0.254: R1.5 16.51,36.83 15.88,36.83 15.88,31.75 15.24,31.75 15.24,27.3 15.88,26.67 15.88,23.5 15.24,22.86 15.24,8.89 13.34,6.99 12.7,6.99 12.7,4.45 J1.12 | v24.13,40.64 24.13,52.07 24.77,52.7 24.77,54.61 25.4,54.61 IC3.7
  Bottom 0.254: v24.13,40.64 17.78,40.64 17.14,40.01 17.14,39.37 16.51,39.37 R1.5

### Text on the board
tPlace: 1541-III V1.1